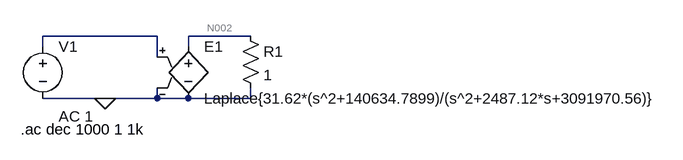
[diagram p0: schematic Draft1.asc]
Draft1.asc, the LTspice schematic file:
Version 4
SHEET 1 1028 680
WIRE 144 128 -32 128
WIRE 288 128 192 128
WIRE -32 144 -32 128
WIRE 192 144 192 128
WIRE 144 160 144 128
WIRE 64 224 -32 224
WIRE 144 224 144 208
WIRE 144 224 64 224
WIRE 192 224 144 224
WIRE 288 224 288 208
WIRE 288 224 192 224
FLAG 64 224 0
SYMBOL e 192 128 R0
SYMATTR InstName E1
SYMATTR Value Laplace{31.62*(s^2+140634.7899)/(s^2+2487.12*s+3091970.56)}
SYMBOL voltage -32 128 R0
WINDOW 123 24 124 Left 2
WINDOW 39 0 0 Left 0
SYMATTR InstName V1
SYMATTR Value ""
SYMATTR Value2 AC 1
SYMBOL res 272 112 R0
SYMATTR InstName R1
SYMATTR Value 1
TEXT -66 272 Left 2 !.ac dec 1000 1 1k

The netlist it stands for:
* Draft1.asc
E1 N002 0 N001 0 Laplace{31.62*(s^2+140634.7899)/(s^2+2487.12*s+3091970.56)}
V1 N001 0 AC 1
R1 N002 0 1
.ac dec 1000 1 1k
.backanno
.end

* Results of the author's LTspice run, read from the files saved beside the schematic
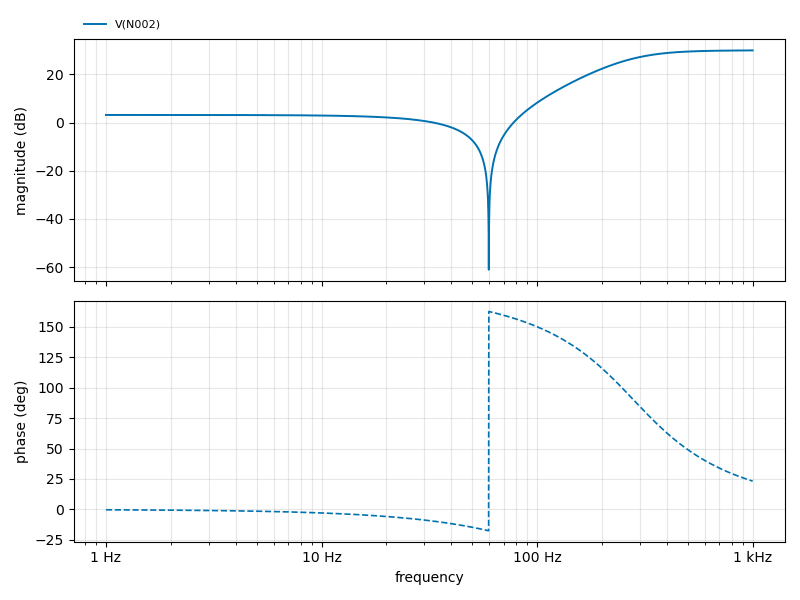
[diagram p1: AC Analysis of Draft1.asc, plotted from the saved traces]
* AC Analysis, 1 run:
*   V(N002): 3.15 dB at 1 Hz, 29.94 dB at 1 kHz, peak 29.94 dB at 1 kHz, 3 dB below the peak at 290.7 Hz